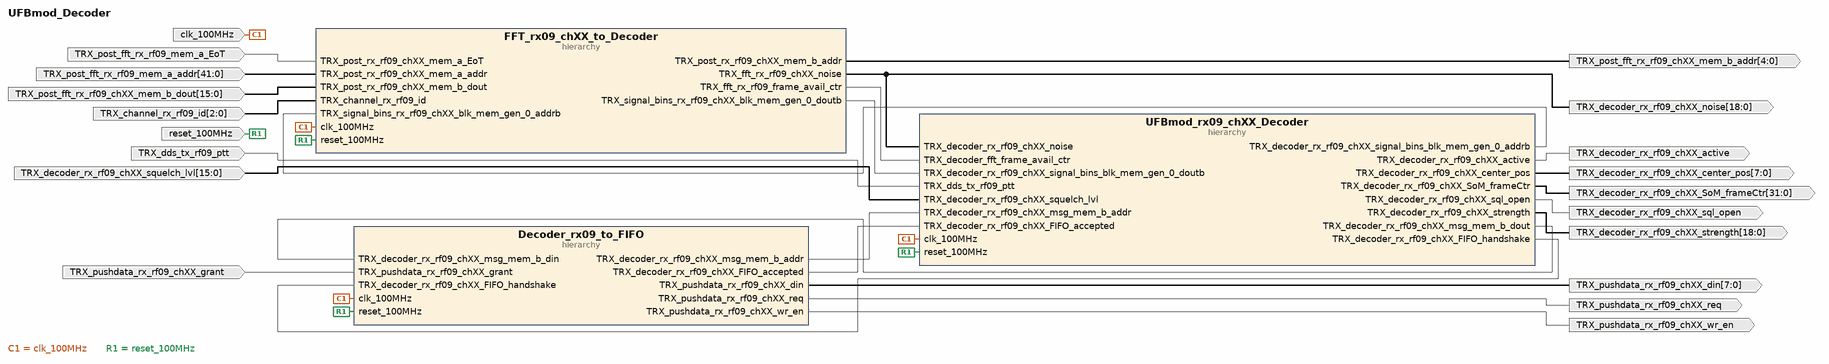
[diagram p0: block diagram of the top level]
# Vivado block design UFBmod_Decoder, xc7a100tfgg484-2, Vivado 2020.2
create_bd_design UFBmod_Decoder

create_bd_port -dir I -type clk clk_100MHz
set_property -dict {CONFIG.ASSOCIATED_RESET reset_100MHz CONFIG.FREQ_HZ 100000000} [get_bd_ports clk_100MHz]
create_bd_port -dir I TRX_dds_tx_rf09_ptt
create_bd_port -dir O TRX_decoder_rx_rf09_chXX_active
create_bd_port -dir O -from 18 -to 0 TRX_decoder_rx_rf09_chXX_noise
create_bd_port -dir O TRX_decoder_rx_rf09_chXX_sql_open
create_bd_port -dir I -from 15 -to 0 -type data TRX_decoder_rx_rf09_chXX_squelch_lvl
create_bd_port -dir I TRX_post_fft_rx_rf09_mem_a_EoT
create_bd_port -dir I -from 41 -to 0 TRX_post_fft_rx_rf09_mem_a_addr
create_bd_port -dir I -from 15 -to 0 -type data TRX_post_fft_rx_rf09_chXX_mem_b_dout
create_bd_port -dir I -type rst reset_100MHz
set_property -dict {CONFIG.POLARITY ACTIVE_HIGH} [get_bd_ports reset_100MHz]
create_bd_port -dir O -from 18 -to 0 -type data TRX_decoder_rx_rf09_chXX_strength
create_bd_port -dir O -from 7 -to 0 -type data TRX_decoder_rx_rf09_chXX_center_pos
create_bd_port -dir O -from 7 -to 0 -type data TRX_pushdata_rx_rf09_chXX_din
create_bd_port -dir O TRX_pushdata_rx_rf09_chXX_wr_en
create_bd_port -dir O -from 4 -to 0 -type data TRX_post_fft_rx_rf09_chXX_mem_b_addr
create_bd_port -dir O TRX_pushdata_rx_rf09_chXX_req
create_bd_port -dir I TRX_pushdata_rx_rf09_chXX_grant
create_bd_port -dir I -from 2 -to 0 -type data TRX_channel_rx_rf09_id
create_bd_port -dir O -from 31 -to 0 -type data TRX_decoder_rx_rf09_chXX_SoM_frameCtr

create_bd_cell -type hier FFT_rx09_chXX_to_Decoder
create_bd_cell -type hier UFBmod_rx09_chXX_Decoder
create_bd_cell -type hier Decoder_rx09_to_FIFO

# ---- hierarchy /FFT_rx09_chXX_to_Decoder ----
current_bd_instance /FFT_rx09_chXX_to_Decoder
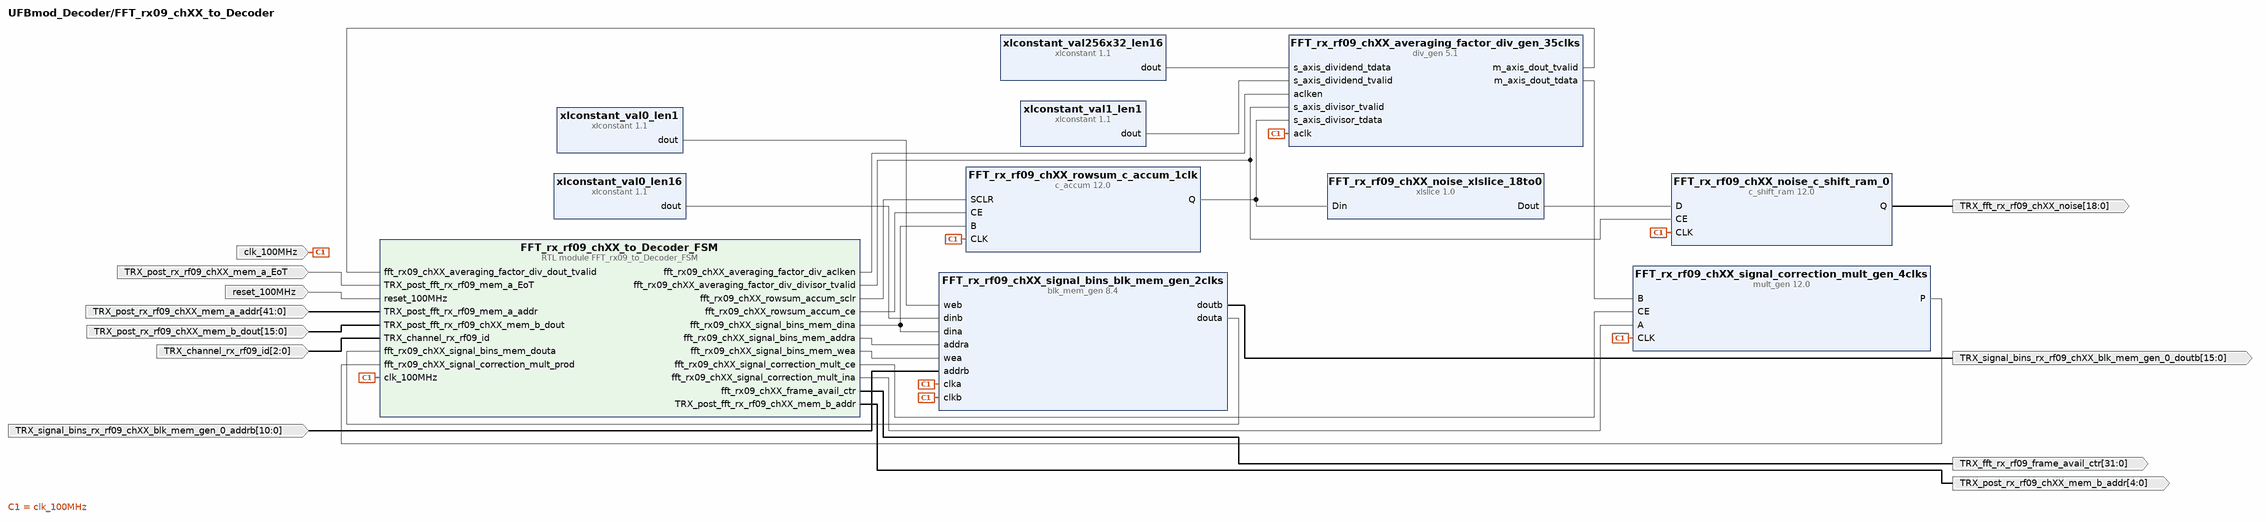
[diagram p1: block diagram inside /FFT_rx09_chXX_to_Decoder]
create_bd_pin -dir I -type clk clk_100MHz
create_bd_pin -dir I -type rst reset_100MHz
create_bd_pin -dir I TRX_post_rx_rf09_chXX_mem_a_EoT
create_bd_pin -dir I -from 41 -to 0 TRX_post_rx_rf09_chXX_mem_a_addr
create_bd_pin -dir O -from 4 -to 0 TRX_post_rx_rf09_chXX_mem_b_addr
create_bd_pin -dir I -from 15 -to 0 -type data TRX_post_rx_rf09_chXX_mem_b_dout
create_bd_pin -dir O -from 31 -to 0 TRX_fft_rx_rf09_frame_avail_ctr
create_bd_pin -dir O -from 15 -to 0 TRX_signal_bins_rx_rf09_chXX_blk_mem_gen_0_doutb
create_bd_pin -dir I -from 10 -to 0 TRX_signal_bins_rx_rf09_chXX_blk_mem_gen_0_addrb
create_bd_pin -dir O -from 18 -to 0 TRX_fft_rx_rf09_chXX_noise
create_bd_pin -dir I -from 2 -to 0 TRX_channel_rx_rf09_id

create_bd_cell -type ip -vlnv xilinx.com:ip:blk_mem_gen:8.4 FFT_rx_rf09_chXX_signal_bins_blk_mem_gen_2clks
set_property -dict [list \
  CONFIG.Assume_Synchronous_Clk true \
  CONFIG.Disable_Collision_Warnings true \
  CONFIG.Enable_32bit_Address false \
  CONFIG.Enable_A Always_Enabled \
  CONFIG.Enable_B Always_Enabled \
  CONFIG.Fill_Remaining_Memory_Locations true \
  CONFIG.Memory_Type True_Dual_Port_RAM \
  CONFIG.Operating_Mode_A NO_CHANGE \
  CONFIG.Operating_Mode_B NO_CHANGE \
  CONFIG.Port_B_Clock 100 \
  CONFIG.Port_B_Enable_Rate 100 \
  CONFIG.Port_B_Write_Rate 50 \
  CONFIG.Read_Width_A 16 \
  CONFIG.Read_Width_B 16 \
  CONFIG.Register_PortA_Output_of_Memory_Primitives true \
  CONFIG.Register_PortB_Output_of_Memory_Primitives true \
  CONFIG.Use_Byte_Write_Enable false \
  CONFIG.Use_RSTA_Pin false \
  CONFIG.Write_Depth_A 2048 \
  CONFIG.Write_Width_A 16 \
  CONFIG.Write_Width_B 16 \
  CONFIG.use_bram_block Stand_Alone \
] [get_bd_cells FFT_rx_rf09_chXX_signal_bins_blk_mem_gen_2clks]
create_bd_cell -type ip -vlnv xilinx.com:ip:xlconstant:1.1 xlconstant_val1_len1
create_bd_cell -type ip -vlnv xilinx.com:ip:c_accum:12.0 FFT_rx_rf09_chXX_rowsum_c_accum_1clk
set_property -dict [list \
  CONFIG.Bypass false \
  CONFIG.CE true \
  CONFIG.Implementation DSP48 \
  CONFIG.Input_Type Unsigned \
  CONFIG.Input_Width 16 \
  CONFIG.Output_Width 32 \
  CONFIG.SCLR true \
] [get_bd_cells FFT_rx_rf09_chXX_rowsum_c_accum_1clk]
create_bd_cell -type ip -vlnv xilinx.com:ip:mult_gen:12.0 FFT_rx_rf09_chXX_signal_correction_mult_gen_4clks
set_property -dict [list \
  CONFIG.ClockEnable true \
  CONFIG.Multiplier_Construction Use_Mults \
  CONFIG.OptGoal Speed \
  CONFIG.OutputWidthHigh 31 \
  CONFIG.OutputWidthLow 16 \
  CONFIG.PipeStages 4 \
  CONFIG.PortAType Unsigned \
  CONFIG.PortAWidth 16 \
  CONFIG.PortBType Unsigned \
  CONFIG.PortBWidth 32 \
  CONFIG.Use_Custom_Output_Width true \
] [get_bd_cells FFT_rx_rf09_chXX_signal_correction_mult_gen_4clks]
create_bd_cell -type ip -vlnv xilinx.com:ip:xlconstant:1.1 xlconstant_val256x32_len16
set_property -dict {CONFIG.CONST_VAL 8192 CONFIG.CONST_WIDTH 16} [get_bd_cells xlconstant_val256x32_len16]
create_bd_cell -type ip -vlnv xilinx.com:ip:xlconstant:1.1 xlconstant_val0_len1
set_property -dict {CONFIG.CONST_VAL 0} [get_bd_cells xlconstant_val0_len1]
create_bd_cell -type ip -vlnv xilinx.com:ip:xlconstant:1.1 xlconstant_val0_len16
set_property -dict {CONFIG.CONST_WIDTH 16} [get_bd_cells xlconstant_val0_len16]
create_bd_cell -type ip -vlnv xilinx.com:ip:xlslice:1.0 FFT_rx_rf09_chXX_noise_xlslice_18to0
set_property -dict {CONFIG.DIN_FROM 18 CONFIG.DOUT_WIDTH 19} [get_bd_cells FFT_rx_rf09_chXX_noise_xlslice_18to0]
create_bd_cell -type ip -vlnv xilinx.com:ip:c_shift_ram:12.0 FFT_rx_rf09_chXX_noise_c_shift_ram_0
set_property -dict [list \
  CONFIG.AsyncInitVal 0000000000000000000 \
  CONFIG.CE true \
  CONFIG.DefaultData 0000000000000000000 \
  CONFIG.Depth 1 \
  CONFIG.Width 19 \
] [get_bd_cells FFT_rx_rf09_chXX_noise_c_shift_ram_0]
create_bd_cell -type module -reference FFT_rx09_to_Decoder_FSM FFT_rx_rf09_chXX_to_Decoder_FSM
create_bd_cell -type ip -vlnv xilinx.com:ip:div_gen:5.1 FFT_rx_rf09_chXX_averaging_factor_div_gen_35clks
set_property -dict [list \
  CONFIG.ACLKEN true \
  CONFIG.FlowControl Blocking \
  CONFIG.OptimizeGoal Resources \
  CONFIG.algorithm_type Radix2 \
  CONFIG.clocks_per_division 1 \
  CONFIG.divide_by_zero_detect true \
  CONFIG.dividend_and_quotient_width 16 \
  CONFIG.divisor_width 32 \
  CONFIG.fractional_width 16 \
  CONFIG.latency 35 \
  CONFIG.latency_configuration Automatic \
  CONFIG.operand_sign Unsigned \
  CONFIG.remainder_type Fractional \
] [get_bd_cells FFT_rx_rf09_chXX_averaging_factor_div_gen_35clks]

# ---- hierarchy /UFBmod_rx09_chXX_Decoder ----
current_bd_instance /UFBmod_rx09_chXX_Decoder
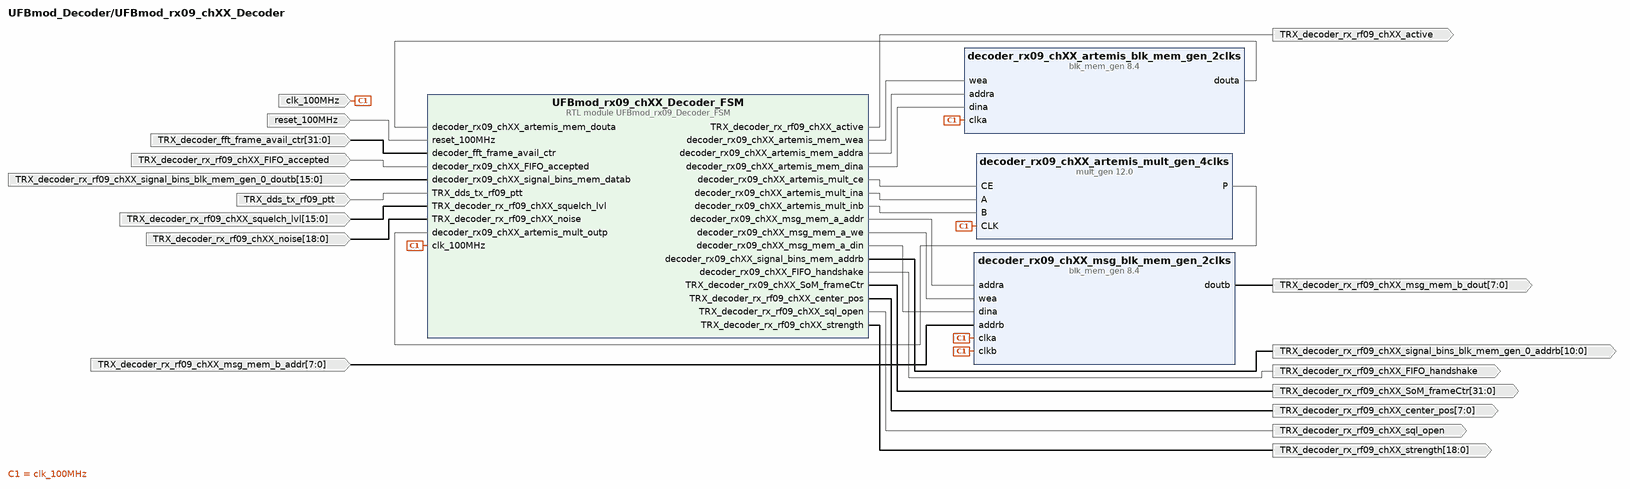
[diagram p2: block diagram inside /UFBmod_rx09_chXX_Decoder]
create_bd_pin -dir I -type rst reset_100MHz
create_bd_pin -dir I -type clk clk_100MHz
create_bd_pin -dir I -from 31 -to 0 TRX_decoder_fft_frame_avail_ctr
create_bd_pin -dir I -from 15 -to 0 TRX_decoder_rx_rf09_chXX_signal_bins_blk_mem_gen_0_doutb
create_bd_pin -dir O -from 10 -to 0 TRX_decoder_rx_rf09_chXX_signal_bins_blk_mem_gen_0_addrb
create_bd_pin -dir I -from 15 -to 0 TRX_decoder_rx_rf09_chXX_squelch_lvl
create_bd_pin -dir I TRX_decoder_rx_rf09_chXX_FIFO_accepted
create_bd_pin -dir O TRX_decoder_rx_rf09_chXX_FIFO_handshake
create_bd_pin -dir O -from 31 -to 0 TRX_decoder_rx_rf09_chXX_SoM_frameCtr
create_bd_pin -dir I TRX_dds_tx_rf09_ptt
create_bd_pin -dir O TRX_decoder_rx_rf09_chXX_sql_open
create_bd_pin -dir O TRX_decoder_rx_rf09_chXX_active
create_bd_pin -dir O -from 18 -to 0 TRX_decoder_rx_rf09_chXX_strength
create_bd_pin -dir O -from 7 -to 0 TRX_decoder_rx_rf09_chXX_center_pos
create_bd_pin -dir O -from 7 -to 0 TRX_decoder_rx_rf09_chXX_msg_mem_b_dout
create_bd_pin -dir I -from 7 -to 0 TRX_decoder_rx_rf09_chXX_msg_mem_b_addr
create_bd_pin -dir I -from 18 -to 0 TRX_decoder_rx_rf09_chXX_noise

create_bd_cell -type ip -vlnv xilinx.com:ip:blk_mem_gen:8.4 decoder_rx09_chXX_artemis_blk_mem_gen_2clks
set_property -dict [list \
  CONFIG.Algorithm Minimum_Area \
  CONFIG.Disable_Collision_Warnings true \
  CONFIG.Enable_32bit_Address false \
  CONFIG.Enable_A Always_Enabled \
  CONFIG.Fill_Remaining_Memory_Locations true \
  CONFIG.Operating_Mode_A NO_CHANGE \
  CONFIG.Read_Width_A 16 \
  CONFIG.Register_PortA_Output_of_Memory_Primitives true \
  CONFIG.Use_Byte_Write_Enable false \
  CONFIG.Use_RSTA_Pin false \
  CONFIG.Write_Depth_A 256 \
  CONFIG.Write_Width_A 16 \
  CONFIG.use_bram_block Stand_Alone \
] [get_bd_cells decoder_rx09_chXX_artemis_blk_mem_gen_2clks]
create_bd_cell -type ip -vlnv xilinx.com:ip:mult_gen:12.0 decoder_rx09_chXX_artemis_mult_gen_4clks
set_property -dict [list \
  CONFIG.ClockEnable true \
  CONFIG.Multiplier_Construction Use_Mults \
  CONFIG.OutputWidthHigh 39 \
  CONFIG.OutputWidthLow 8 \
  CONFIG.PortAType Unsigned \
  CONFIG.PortAWidth 16 \
  CONFIG.PortBType Unsigned \
  CONFIG.PortBWidth 32 \
  CONFIG.Use_Custom_Output_Width true \
] [get_bd_cells decoder_rx09_chXX_artemis_mult_gen_4clks]
create_bd_cell -type ip -vlnv xilinx.com:ip:blk_mem_gen:8.4 decoder_rx09_chXX_msg_blk_mem_gen_2clks
set_property -dict [list \
  CONFIG.Assume_Synchronous_Clk true \
  CONFIG.Disable_Collision_Warnings true \
  CONFIG.Enable_32bit_Address false \
  CONFIG.Enable_A Always_Enabled \
  CONFIG.Enable_B Always_Enabled \
  CONFIG.Fill_Remaining_Memory_Locations true \
  CONFIG.Memory_Type Simple_Dual_Port_RAM \
  CONFIG.Operating_Mode_A NO_CHANGE \
  CONFIG.Port_B_Clock 100 \
  CONFIG.Port_B_Enable_Rate 100 \
  CONFIG.Read_Width_B 8 \
  CONFIG.Register_PortB_Output_of_Memory_Core false \
  CONFIG.Register_PortB_Output_of_Memory_Primitives true \
  CONFIG.Use_Byte_Write_Enable false \
  CONFIG.Use_RSTB_Pin false \
  CONFIG.Write_Depth_A 256 \
  CONFIG.Write_Width_A 8 \
  CONFIG.Write_Width_B 8 \
  CONFIG.use_bram_block Stand_Alone \
] [get_bd_cells decoder_rx09_chXX_msg_blk_mem_gen_2clks]
create_bd_cell -type module -reference UFBmod_rx09_Decoder_FSM UFBmod_rx09_chXX_Decoder_FSM

# ---- hierarchy /Decoder_rx09_to_FIFO ----
current_bd_instance /Decoder_rx09_to_FIFO
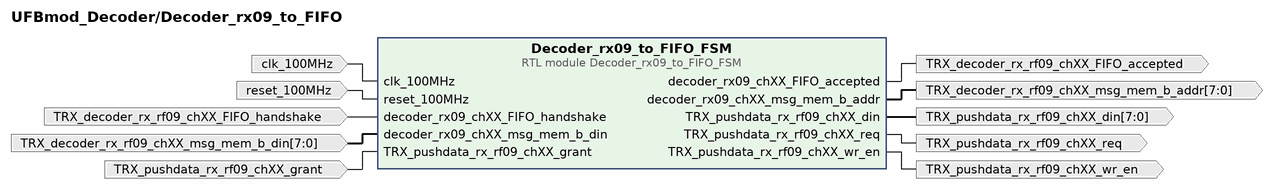
[diagram p3: block diagram inside /Decoder_rx09_to_FIFO]
create_bd_pin -dir I clk_100MHz
create_bd_pin -dir I -type rst reset_100MHz
create_bd_pin -dir I -from 7 -to 0 TRX_decoder_rx_rf09_chXX_msg_mem_b_din
create_bd_pin -dir O -from 7 -to 0 TRX_decoder_rx_rf09_chXX_msg_mem_b_addr
create_bd_pin -dir O TRX_decoder_rx_rf09_chXX_FIFO_accepted
create_bd_pin -dir I TRX_decoder_rx_rf09_chXX_FIFO_handshake
create_bd_pin -dir O -from 7 -to 0 TRX_pushdata_rx_rf09_chXX_din
create_bd_pin -dir O TRX_pushdata_rx_rf09_chXX_wr_en
create_bd_pin -dir O TRX_pushdata_rx_rf09_chXX_req
create_bd_pin -dir I TRX_pushdata_rx_rf09_chXX_grant

create_bd_cell -type module -reference Decoder_rx09_to_FIFO_FSM Decoder_rx09_to_FIFO_FSM

# ---- connections ----

current_bd_instance /FFT_rx09_chXX_to_Decoder
connect_bd_net [get_bd_pins clk_100MHz] \
  [get_bd_pins FFT_rx_rf09_chXX_signal_bins_blk_mem_gen_2clks/clkb] \
  [get_bd_pins FFT_rx_rf09_chXX_signal_bins_blk_mem_gen_2clks/clka] [get_bd_pins FFT_rx_rf09_chXX_rowsum_c_accum_1clk/CLK] \
  [get_bd_pins FFT_rx_rf09_chXX_signal_correction_mult_gen_4clks/CLK] [get_bd_pins FFT_rx_rf09_chXX_noise_c_shift_ram_0/CLK] \
  [get_bd_pins FFT_rx_rf09_chXX_to_Decoder_FSM/clk_100MHz] \
  [get_bd_pins FFT_rx_rf09_chXX_averaging_factor_div_gen_35clks/aclk]
connect_bd_net -net fft_rx09_chXX_signal_bins_blk_mem_gen_0_doutb_0 [get_bd_pins FFT_rx_rf09_chXX_signal_bins_blk_mem_gen_2clks/doutb] \
  [get_bd_pins TRX_signal_bins_rx_rf09_chXX_blk_mem_gen_0_doutb]
connect_bd_net -net TRX_fft_rx09_chXX_signal_bins_blk_mem_gen_0_addrb_0 [get_bd_pins TRX_signal_bins_rx_rf09_chXX_blk_mem_gen_0_addrb] \
  [get_bd_pins FFT_rx_rf09_chXX_signal_bins_blk_mem_gen_2clks/addrb]
connect_bd_net -net TRX_post_fft_rx09_mem_a_EoT_0 [get_bd_pins TRX_post_rx_rf09_chXX_mem_a_EoT] \
  [get_bd_pins FFT_rx_rf09_chXX_to_Decoder_FSM/TRX_post_fft_rx_rf09_mem_a_EoT]
connect_bd_net -net fft_rx09_chXX_signal_bins_blk_mem_gen_0_dina_0 [get_bd_pins FFT_rx_rf09_chXX_to_Decoder_FSM/fft_rx09_chXX_signal_bins_mem_dina] \
  [get_bd_pins FFT_rx_rf09_chXX_rowsum_c_accum_1clk/B] [get_bd_pins FFT_rx_rf09_chXX_signal_bins_blk_mem_gen_2clks/dina]
connect_bd_net -net fft_rx09_chXX_averaging_factor_div_dout_tdata_0 [get_bd_pins FFT_rx_rf09_chXX_averaging_factor_div_gen_35clks/m_axis_dout_tdata] \
  [get_bd_pins FFT_rx_rf09_chXX_signal_correction_mult_gen_4clks/B]
connect_bd_net -net fft_rx09_chXX_averaging_factor_div_divisor_tdata_0 [get_bd_pins FFT_rx_rf09_chXX_rowsum_c_accum_1clk/Q] \
  [get_bd_pins FFT_rx_rf09_chXX_noise_xlslice_18to0/Din] \
  [get_bd_pins FFT_rx_rf09_chXX_averaging_factor_div_gen_35clks/s_axis_divisor_tdata]
connect_bd_net -net fft_rx09_chXX_averaging_factor_div_dividend_tdata_0 [get_bd_pins xlconstant_val256x32_len16/dout] \
  [get_bd_pins FFT_rx_rf09_chXX_averaging_factor_div_gen_35clks/s_axis_dividend_tdata]
connect_bd_net -net fft_rx09_chXX_averaging_factor_div_dividend_tvalid_0 [get_bd_pins xlconstant_val1_len1/dout] \
  [get_bd_pins FFT_rx_rf09_chXX_averaging_factor_div_gen_35clks/s_axis_dividend_tvalid]
connect_bd_net [get_bd_pins xlconstant_val0_len1/dout] [get_bd_pins FFT_rx_rf09_chXX_signal_bins_blk_mem_gen_2clks/web]
connect_bd_net [get_bd_pins xlconstant_val0_len16/dout] [get_bd_pins FFT_rx_rf09_chXX_signal_bins_blk_mem_gen_2clks/dinb]
connect_bd_net -net fft_rx09_chXX_averaging_factor_div_dout_tvalid_0 [get_bd_pins FFT_rx_rf09_chXX_averaging_factor_div_gen_35clks/m_axis_dout_tvalid] \
  [get_bd_pins FFT_rx_rf09_chXX_to_Decoder_FSM/fft_rx09_chXX_averaging_factor_div_dout_tvalid]
connect_bd_net -net fft_rx09_chXX_averaging_factor_div_divisor_tvalid_0 [get_bd_pins FFT_rx_rf09_chXX_to_Decoder_FSM/fft_rx09_chXX_averaging_factor_div_divisor_tvalid] \
  [get_bd_pins FFT_rx_rf09_chXX_noise_c_shift_ram_0/CE] \
  [get_bd_pins FFT_rx_rf09_chXX_averaging_factor_div_gen_35clks/s_axis_divisor_tvalid]
connect_bd_net -net fft_rx09_chXX_noise_xlslice_18to0_Dout_0 [get_bd_pins FFT_rx_rf09_chXX_noise_xlslice_18to0/Dout] \
  [get_bd_pins FFT_rx_rf09_chXX_noise_c_shift_ram_0/D]
connect_bd_net -net fft_rx09_chXX_noise_c_shift_ram_Q_0 [get_bd_pins FFT_rx_rf09_chXX_noise_c_shift_ram_0/Q] [get_bd_pins TRX_fft_rx_rf09_chXX_noise]
connect_bd_net [get_bd_pins reset_100MHz] [get_bd_pins FFT_rx_rf09_chXX_to_Decoder_FSM/reset_100MHz]
connect_bd_net -net fft_rx09_chXX_averaging_factor_div_aclken_0 [get_bd_pins FFT_rx_rf09_chXX_to_Decoder_FSM/fft_rx09_chXX_averaging_factor_div_aclken] \
  [get_bd_pins FFT_rx_rf09_chXX_averaging_factor_div_gen_35clks/aclken]
connect_bd_net -net fft_rx09_chXX_signal_correction_mult_ce_0 [get_bd_pins FFT_rx_rf09_chXX_to_Decoder_FSM/fft_rx09_chXX_signal_correction_mult_ce] \
  [get_bd_pins FFT_rx_rf09_chXX_signal_correction_mult_gen_4clks/CE]
connect_bd_net -net fft_rx09_chXX_signal_correction_mult_ina_0 [get_bd_pins FFT_rx_rf09_chXX_to_Decoder_FSM/fft_rx09_chXX_signal_correction_mult_ina] \
  [get_bd_pins FFT_rx_rf09_chXX_signal_correction_mult_gen_4clks/A]
connect_bd_net -net fft_rx09_chXX_rowsum_accum_sclr_0 [get_bd_pins FFT_rx_rf09_chXX_to_Decoder_FSM/fft_rx09_chXX_rowsum_accum_sclr] \
  [get_bd_pins FFT_rx_rf09_chXX_rowsum_c_accum_1clk/SCLR]
connect_bd_net -net fft_rx09_chXX_rowsum_accum_ce_0 [get_bd_pins FFT_rx_rf09_chXX_to_Decoder_FSM/fft_rx09_chXX_rowsum_accum_ce] \
  [get_bd_pins FFT_rx_rf09_chXX_rowsum_c_accum_1clk/CE]
connect_bd_net -net fft_rx09_chXX_signal_bins_mem_addra_0 [get_bd_pins FFT_rx_rf09_chXX_to_Decoder_FSM/fft_rx09_chXX_signal_bins_mem_addra] \
  [get_bd_pins FFT_rx_rf09_chXX_signal_bins_blk_mem_gen_2clks/addra]
connect_bd_net -net fft_rx09_chXX_signal_bins_mem_wea_0 [get_bd_pins FFT_rx_rf09_chXX_to_Decoder_FSM/fft_rx09_chXX_signal_bins_mem_wea] \
  [get_bd_pins FFT_rx_rf09_chXX_signal_bins_blk_mem_gen_2clks/wea]
connect_bd_net -net fft_rx09_chXX_frame_avail_ctr_0 [get_bd_pins FFT_rx_rf09_chXX_to_Decoder_FSM/fft_rx09_chXX_frame_avail_ctr] \
  [get_bd_pins TRX_fft_rx_rf09_frame_avail_ctr]
connect_bd_net -net fft_rx09_chXX_signal_correction_mult_gen_4clks_P_0 [get_bd_pins FFT_rx_rf09_chXX_signal_correction_mult_gen_4clks/P] \
  [get_bd_pins FFT_rx_rf09_chXX_to_Decoder_FSM/fft_rx09_chXX_signal_correction_mult_prod]
connect_bd_net -net fft_rx09_chXX_signal_bins_blk_mem_gen_2clks_douta_0 [get_bd_pins FFT_rx_rf09_chXX_signal_bins_blk_mem_gen_2clks/douta] \
  [get_bd_pins FFT_rx_rf09_chXX_to_Decoder_FSM/fft_rx09_chXX_signal_bins_mem_douta]
connect_bd_net [get_bd_pins TRX_post_rx_rf09_chXX_mem_a_addr] [get_bd_pins FFT_rx_rf09_chXX_to_Decoder_FSM/TRX_post_fft_rx_rf09_mem_a_addr]
connect_bd_net [get_bd_pins TRX_post_rx_rf09_chXX_mem_b_dout] [get_bd_pins FFT_rx_rf09_chXX_to_Decoder_FSM/TRX_post_fft_rx_rf09_chXX_mem_b_dout]
connect_bd_net -net TRX_post_fft_rx_rf09_chXX_mem_b_addr_0 [get_bd_pins FFT_rx_rf09_chXX_to_Decoder_FSM/TRX_post_fft_rx_rf09_chXX_mem_b_addr] \
  [get_bd_pins TRX_post_rx_rf09_chXX_mem_b_addr]
connect_bd_net [get_bd_pins TRX_channel_rx_rf09_id] [get_bd_pins FFT_rx_rf09_chXX_to_Decoder_FSM/TRX_channel_rx_rf09_id]

current_bd_instance /UFBmod_rx09_chXX_Decoder
connect_bd_net [get_bd_pins reset_100MHz] [get_bd_pins UFBmod_rx09_chXX_Decoder_FSM/reset_100MHz]
connect_bd_net [get_bd_pins clk_100MHz] \
  [get_bd_pins decoder_rx09_chXX_artemis_blk_mem_gen_2clks/clka] [get_bd_pins decoder_rx09_chXX_artemis_mult_gen_4clks/CLK] \
  [get_bd_pins decoder_rx09_chXX_msg_blk_mem_gen_2clks/clka] [get_bd_pins decoder_rx09_chXX_msg_blk_mem_gen_2clks/clkb] \
  [get_bd_pins UFBmod_rx09_chXX_Decoder_FSM/clk_100MHz]
connect_bd_net [get_bd_pins TRX_decoder_fft_frame_avail_ctr] [get_bd_pins UFBmod_rx09_chXX_Decoder_FSM/decoder_fft_frame_avail_ctr]
connect_bd_net [get_bd_pins TRX_decoder_rx_rf09_chXX_FIFO_accepted] [get_bd_pins UFBmod_rx09_chXX_Decoder_FSM/decoder_rx09_chXX_FIFO_accepted]
connect_bd_net -net TRX_decoder_rx_rf09_chXX_signal_bins_blk_mem_gen_0_addrb_1 [get_bd_pins UFBmod_rx09_chXX_Decoder_FSM/decoder_rx09_chXX_signal_bins_mem_addrb] \
  [get_bd_pins TRX_decoder_rx_rf09_chXX_signal_bins_blk_mem_gen_0_addrb]
connect_bd_net -net TRX_decoder_rx_rf09_chXX_SoM_frameCtr_1 [get_bd_pins UFBmod_rx09_chXX_Decoder_FSM/TRX_decoder_rx09_chXX_SoM_frameCtr] \
  [get_bd_pins TRX_decoder_rx_rf09_chXX_SoM_frameCtr]
connect_bd_net -net TRX_decoder_rx_rf09_chXX_sql_open_1 [get_bd_pins UFBmod_rx09_chXX_Decoder_FSM/TRX_decoder_rx_rf09_chXX_sql_open] \
  [get_bd_pins TRX_decoder_rx_rf09_chXX_sql_open]
connect_bd_net -net TRX_decoder_rx_rf09_chXX_active_1 [get_bd_pins UFBmod_rx09_chXX_Decoder_FSM/TRX_decoder_rx_rf09_chXX_active] \
  [get_bd_pins TRX_decoder_rx_rf09_chXX_active]
connect_bd_net -net TRX_decoder_rx_rf09_chXX_FIFO_handshake_1 [get_bd_pins UFBmod_rx09_chXX_Decoder_FSM/decoder_rx09_chXX_FIFO_handshake] \
  [get_bd_pins TRX_decoder_rx_rf09_chXX_FIFO_handshake]
connect_bd_net [get_bd_pins TRX_decoder_rx_rf09_chXX_signal_bins_blk_mem_gen_0_doutb] \
  [get_bd_pins UFBmod_rx09_chXX_Decoder_FSM/decoder_rx09_chXX_signal_bins_mem_datab]
connect_bd_net -net TRX_decoder_rx_rf09_chXX_artemis_blk_mem_gen_0_douta_1 [get_bd_pins decoder_rx09_chXX_artemis_blk_mem_gen_2clks/douta] \
  [get_bd_pins UFBmod_rx09_chXX_Decoder_FSM/decoder_rx09_chXX_artemis_mem_douta]
connect_bd_net -net TRX_decoder_artemis_rx_rf09_chXX_mem_wea_1 [get_bd_pins UFBmod_rx09_chXX_Decoder_FSM/decoder_rx09_chXX_artemis_mem_wea] \
  [get_bd_pins decoder_rx09_chXX_artemis_blk_mem_gen_2clks/wea]
connect_bd_net -net TRX_decoder_rx_rf09_chXX_artemis_mem_addra_1 [get_bd_pins UFBmod_rx09_chXX_Decoder_FSM/decoder_rx09_chXX_artemis_mem_addra] \
  [get_bd_pins decoder_rx09_chXX_artemis_blk_mem_gen_2clks/addra]
connect_bd_net -net TRX_decoder_artemis_rx_rf09_chXX_mem_dina_1 [get_bd_pins UFBmod_rx09_chXX_Decoder_FSM/decoder_rx09_chXX_artemis_mem_dina] \
  [get_bd_pins decoder_rx09_chXX_artemis_blk_mem_gen_2clks/dina]
connect_bd_net -net TRX_decoder_rx_rf09_chXX_artemis_mult_gen_4clks_P_1 [get_bd_pins decoder_rx09_chXX_artemis_mult_gen_4clks/P] \
  [get_bd_pins UFBmod_rx09_chXX_Decoder_FSM/decoder_rx09_chXX_artemis_mult_outp]
connect_bd_net -net TRX_decoder_artemis_rx_rf09_chXX_mult_ce_1 [get_bd_pins UFBmod_rx09_chXX_Decoder_FSM/decoder_rx09_chXX_artemis_mult_ce] \
  [get_bd_pins decoder_rx09_chXX_artemis_mult_gen_4clks/CE]
connect_bd_net -net TRX_decoder_artemis_rx_rf09_chXX_mult_ina_1 [get_bd_pins UFBmod_rx09_chXX_Decoder_FSM/decoder_rx09_chXX_artemis_mult_ina] \
  [get_bd_pins decoder_rx09_chXX_artemis_mult_gen_4clks/A]
connect_bd_net -net TRX_decoder_artemis_rx_rf09_chXX_mult_inb_1 [get_bd_pins UFBmod_rx09_chXX_Decoder_FSM/decoder_rx09_chXX_artemis_mult_inb] \
  [get_bd_pins decoder_rx09_chXX_artemis_mult_gen_4clks/B]
connect_bd_net -net TRX_decoder_rx_rf09_chXX_strength_1 [get_bd_pins UFBmod_rx09_chXX_Decoder_FSM/TRX_decoder_rx_rf09_chXX_strength] \
  [get_bd_pins TRX_decoder_rx_rf09_chXX_strength]
connect_bd_net -net TRX_decoder_rx_rf09_chXX_center_pos_1 [get_bd_pins UFBmod_rx09_chXX_Decoder_FSM/TRX_decoder_rx_rf09_chXX_center_pos] \
  [get_bd_pins TRX_decoder_rx_rf09_chXX_center_pos]
connect_bd_net -net TRX_decoder_rx_rf09_chXX_msg_mem_a_addr_0 [get_bd_pins UFBmod_rx09_chXX_Decoder_FSM/decoder_rx09_chXX_msg_mem_a_addr] \
  [get_bd_pins decoder_rx09_chXX_msg_blk_mem_gen_2clks/addra]
connect_bd_net -net TRX_decoder_rx_rf09_chXX_msg_mem_a_we_0 [get_bd_pins UFBmod_rx09_chXX_Decoder_FSM/decoder_rx09_chXX_msg_mem_a_we] \
  [get_bd_pins decoder_rx09_chXX_msg_blk_mem_gen_2clks/wea]
connect_bd_net -net TRX_decoder_rx_rf09_chXX_msg_mem_a_din_0 [get_bd_pins UFBmod_rx09_chXX_Decoder_FSM/decoder_rx09_chXX_msg_mem_a_din] \
  [get_bd_pins decoder_rx09_chXX_msg_blk_mem_gen_2clks/dina]
connect_bd_net -net TRX_decoder_rx_rf09_chXX_msg_blk_mem_gen_2clks_doutb_1 [get_bd_pins decoder_rx09_chXX_msg_blk_mem_gen_2clks/doutb] \
  [get_bd_pins TRX_decoder_rx_rf09_chXX_msg_mem_b_dout]
connect_bd_net [get_bd_pins TRX_decoder_rx_rf09_chXX_msg_mem_b_addr] [get_bd_pins decoder_rx09_chXX_msg_blk_mem_gen_2clks/addrb]
connect_bd_net [get_bd_pins TRX_dds_tx_rf09_ptt] [get_bd_pins UFBmod_rx09_chXX_Decoder_FSM/TRX_dds_tx_rf09_ptt]
connect_bd_net -net TRX_decoder_rx_rf09_ch00_squelch_lvl_1 [get_bd_pins TRX_decoder_rx_rf09_chXX_squelch_lvl] \
  [get_bd_pins UFBmod_rx09_chXX_Decoder_FSM/TRX_decoder_rx_rf09_chXX_squelch_lvl]
connect_bd_net [get_bd_pins TRX_decoder_rx_rf09_chXX_noise] [get_bd_pins UFBmod_rx09_chXX_Decoder_FSM/TRX_decoder_rx_rf09_chXX_noise]

current_bd_instance /Decoder_rx09_to_FIFO
connect_bd_net [get_bd_pins clk_100MHz] [get_bd_pins Decoder_rx09_to_FIFO_FSM/clk_100MHz]
connect_bd_net [get_bd_pins reset_100MHz] [get_bd_pins Decoder_rx09_to_FIFO_FSM/reset_100MHz]
connect_bd_net -net TRX_decoder_rx_rf09_chXX_msg_mem_b_addr_0 [get_bd_pins Decoder_rx09_to_FIFO_FSM/decoder_rx09_chXX_msg_mem_b_addr] \
  [get_bd_pins TRX_decoder_rx_rf09_chXX_msg_mem_b_addr]
connect_bd_net -net TRX_decoder_rx_rf09_chXX_FIFO_accepted_0 [get_bd_pins Decoder_rx09_to_FIFO_FSM/decoder_rx09_chXX_FIFO_accepted] \
  [get_bd_pins TRX_decoder_rx_rf09_chXX_FIFO_accepted]
connect_bd_net [get_bd_pins TRX_decoder_rx_rf09_chXX_FIFO_handshake] [get_bd_pins Decoder_rx09_to_FIFO_FSM/decoder_rx09_chXX_FIFO_handshake]
connect_bd_net -net TRX_pushdata_rx_rf09_chXX_din_0 [get_bd_pins Decoder_rx09_to_FIFO_FSM/TRX_pushdata_rx_rf09_chXX_din] \
  [get_bd_pins TRX_pushdata_rx_rf09_chXX_din]
connect_bd_net -net TRX_pushdata_rx_rf09_chXX_wr_en_0 [get_bd_pins Decoder_rx09_to_FIFO_FSM/TRX_pushdata_rx_rf09_chXX_wr_en] \
  [get_bd_pins TRX_pushdata_rx_rf09_chXX_wr_en]
connect_bd_net -net TRX_decoder_rx_rf09_chXX_msg_mem_b_dout_0 [get_bd_pins TRX_decoder_rx_rf09_chXX_msg_mem_b_din] \
  [get_bd_pins Decoder_rx09_to_FIFO_FSM/decoder_rx09_chXX_msg_mem_b_din]
connect_bd_net -net TRX_pushdata_rx_rf09_chXX_req_2 [get_bd_pins Decoder_rx09_to_FIFO_FSM/TRX_pushdata_rx_rf09_chXX_req] \
  [get_bd_pins TRX_pushdata_rx_rf09_chXX_req]
connect_bd_net [get_bd_pins TRX_pushdata_rx_rf09_chXX_grant] [get_bd_pins Decoder_rx09_to_FIFO_FSM/TRX_pushdata_rx_rf09_chXX_grant]

current_bd_instance /
connect_bd_net -net TRX_decoder_rx09_chXX_noise_0 [get_bd_pins FFT_rx09_chXX_to_Decoder/TRX_fft_rx_rf09_chXX_noise] \
  [get_bd_ports TRX_decoder_rx_rf09_chXX_noise] [get_bd_pins UFBmod_rx09_chXX_Decoder/TRX_decoder_rx_rf09_chXX_noise]
connect_bd_net [get_bd_ports clk_100MHz] \
  [get_bd_pins FFT_rx09_chXX_to_Decoder/clk_100MHz] [get_bd_pins UFBmod_rx09_chXX_Decoder/clk_100MHz] \
  [get_bd_pins Decoder_rx09_to_FIFO/clk_100MHz]
connect_bd_net [get_bd_ports TRX_dds_tx_rf09_ptt] [get_bd_pins UFBmod_rx09_chXX_Decoder/TRX_dds_tx_rf09_ptt]
connect_bd_net -net TRX_decoder_fft_frame_avail_ctr_0 [get_bd_pins FFT_rx09_chXX_to_Decoder/TRX_fft_rx_rf09_frame_avail_ctr] \
  [get_bd_pins UFBmod_rx09_chXX_Decoder/TRX_decoder_fft_frame_avail_ctr]
connect_bd_net -net TRX_decoder_rx09_chXX_active_0 [get_bd_pins UFBmod_rx09_chXX_Decoder/TRX_decoder_rx_rf09_chXX_active] \
  [get_bd_ports TRX_decoder_rx_rf09_chXX_active]
connect_bd_net -net TRX_decoder_rx09_chXX_sql_open_0 [get_bd_pins UFBmod_rx09_chXX_Decoder/TRX_decoder_rx_rf09_chXX_sql_open] \
  [get_bd_ports TRX_decoder_rx_rf09_chXX_sql_open]
connect_bd_net -net TRX_decoder_rx09_chXX_squelch_lvl_1 [get_bd_ports TRX_decoder_rx_rf09_chXX_squelch_lvl] \
  [get_bd_pins UFBmod_rx09_chXX_Decoder/TRX_decoder_rx_rf09_chXX_squelch_lvl]
connect_bd_net -net TRX_post_fft_rx09_mem_a_EoT_0 [get_bd_ports TRX_post_fft_rx_rf09_mem_a_EoT] \
  [get_bd_pins FFT_rx09_chXX_to_Decoder/TRX_post_rx_rf09_chXX_mem_a_EoT]
connect_bd_net -net TRX_post_fft_rx09_mem_a_addr_0 [get_bd_ports TRX_post_fft_rx_rf09_mem_a_addr] \
  [get_bd_pins FFT_rx09_chXX_to_Decoder/TRX_post_rx_rf09_chXX_mem_a_addr]
connect_bd_net -net TRX_post_fft_rx09_chXX_mem_b_dout_0 [get_bd_ports TRX_post_fft_rx_rf09_chXX_mem_b_dout] \
  [get_bd_pins FFT_rx09_chXX_to_Decoder/TRX_post_rx_rf09_chXX_mem_b_dout]
connect_bd_net [get_bd_ports reset_100MHz] \
  [get_bd_pins FFT_rx09_chXX_to_Decoder/reset_100MHz] [get_bd_pins UFBmod_rx09_chXX_Decoder/reset_100MHz] \
  [get_bd_pins Decoder_rx09_to_FIFO/reset_100MHz]
connect_bd_net -net TRX_fft_rx09_chXX_signal_bins_blk_mem_gen_0_addrb_1 [get_bd_pins UFBmod_rx09_chXX_Decoder/TRX_decoder_rx_rf09_chXX_signal_bins_blk_mem_gen_0_addrb] \
  [get_bd_pins FFT_rx09_chXX_to_Decoder/TRX_signal_bins_rx_rf09_chXX_blk_mem_gen_0_addrb]
connect_bd_net -net TRX_decoder_rx09_chXX_signal_bins_blk_mem_gen_0_doutb_0 [get_bd_pins FFT_rx09_chXX_to_Decoder/TRX_signal_bins_rx_rf09_chXX_blk_mem_gen_0_doutb] \
  [get_bd_pins UFBmod_rx09_chXX_Decoder/TRX_decoder_rx_rf09_chXX_signal_bins_blk_mem_gen_0_doutb]
connect_bd_net -net TRX_decoder_rx09_chXX_strength_0 [get_bd_pins UFBmod_rx09_chXX_Decoder/TRX_decoder_rx_rf09_chXX_strength] \
  [get_bd_ports TRX_decoder_rx_rf09_chXX_strength]
connect_bd_net -net TRX_decoder_rx09_chXX_center_pos_0 [get_bd_pins UFBmod_rx09_chXX_Decoder/TRX_decoder_rx_rf09_chXX_center_pos] \
  [get_bd_ports TRX_decoder_rx_rf09_chXX_center_pos]
connect_bd_net -net TRX_decoder_rx09_chXX_msg_mem_b_dout_0 [get_bd_pins UFBmod_rx09_chXX_Decoder/TRX_decoder_rx_rf09_chXX_msg_mem_b_dout] \
  [get_bd_pins Decoder_rx09_to_FIFO/TRX_decoder_rx_rf09_chXX_msg_mem_b_din]
connect_bd_net -net TRX_decoder_rx09_chXX_msg_mem_b_addr_1 [get_bd_pins Decoder_rx09_to_FIFO/TRX_decoder_rx_rf09_chXX_msg_mem_b_addr] \
  [get_bd_pins UFBmod_rx09_chXX_Decoder/TRX_decoder_rx_rf09_chXX_msg_mem_b_addr]
connect_bd_net -net TRX_decoder_rx09_chXX_FIFO_accepted_1 [get_bd_pins Decoder_rx09_to_FIFO/TRX_decoder_rx_rf09_chXX_FIFO_accepted] \
  [get_bd_pins UFBmod_rx09_chXX_Decoder/TRX_decoder_rx_rf09_chXX_FIFO_accepted]
connect_bd_net -net TRX_decoder_rx09_chXX_FIFO_handshake_0 [get_bd_pins UFBmod_rx09_chXX_Decoder/TRX_decoder_rx_rf09_chXX_FIFO_handshake] \
  [get_bd_pins Decoder_rx09_to_FIFO/TRX_decoder_rx_rf09_chXX_FIFO_handshake]
connect_bd_net -net TRX_pushdata_rx_rf09_chXX_din_0 [get_bd_pins Decoder_rx09_to_FIFO/TRX_pushdata_rx_rf09_chXX_din] \
  [get_bd_ports TRX_pushdata_rx_rf09_chXX_din]
connect_bd_net -net TRX_pushdata_rx_rf09_chXX_wr_en_0 [get_bd_pins Decoder_rx09_to_FIFO/TRX_pushdata_rx_rf09_chXX_wr_en] \
  [get_bd_ports TRX_pushdata_rx_rf09_chXX_wr_en]
connect_bd_net -net TRX_post_fft_rx09_chXX_mem_b_addr_0 [get_bd_pins FFT_rx09_chXX_to_Decoder/TRX_post_rx_rf09_chXX_mem_b_addr] \
  [get_bd_ports TRX_post_fft_rx_rf09_chXX_mem_b_addr]
connect_bd_net -net TRX_pushdata_rx_rf09_chXX_req_2 [get_bd_pins Decoder_rx09_to_FIFO/TRX_pushdata_rx_rf09_chXX_req] \
  [get_bd_ports TRX_pushdata_rx_rf09_chXX_req]
connect_bd_net [get_bd_ports TRX_pushdata_rx_rf09_chXX_grant] [get_bd_pins Decoder_rx09_to_FIFO/TRX_pushdata_rx_rf09_chXX_grant]
connect_bd_net [get_bd_ports TRX_channel_rx_rf09_id] [get_bd_pins FFT_rx09_chXX_to_Decoder/TRX_channel_rx_rf09_id]
connect_bd_net [get_bd_pins UFBmod_rx09_chXX_Decoder/TRX_decoder_rx_rf09_chXX_SoM_frameCtr] [get_bd_ports TRX_decoder_rx_rf09_chXX_SoM_frameCtr]

validate_bd_design
save_bd_design
